# EAGLE board video-max5-revG-eagle7 (EAGLE 7.6.0)
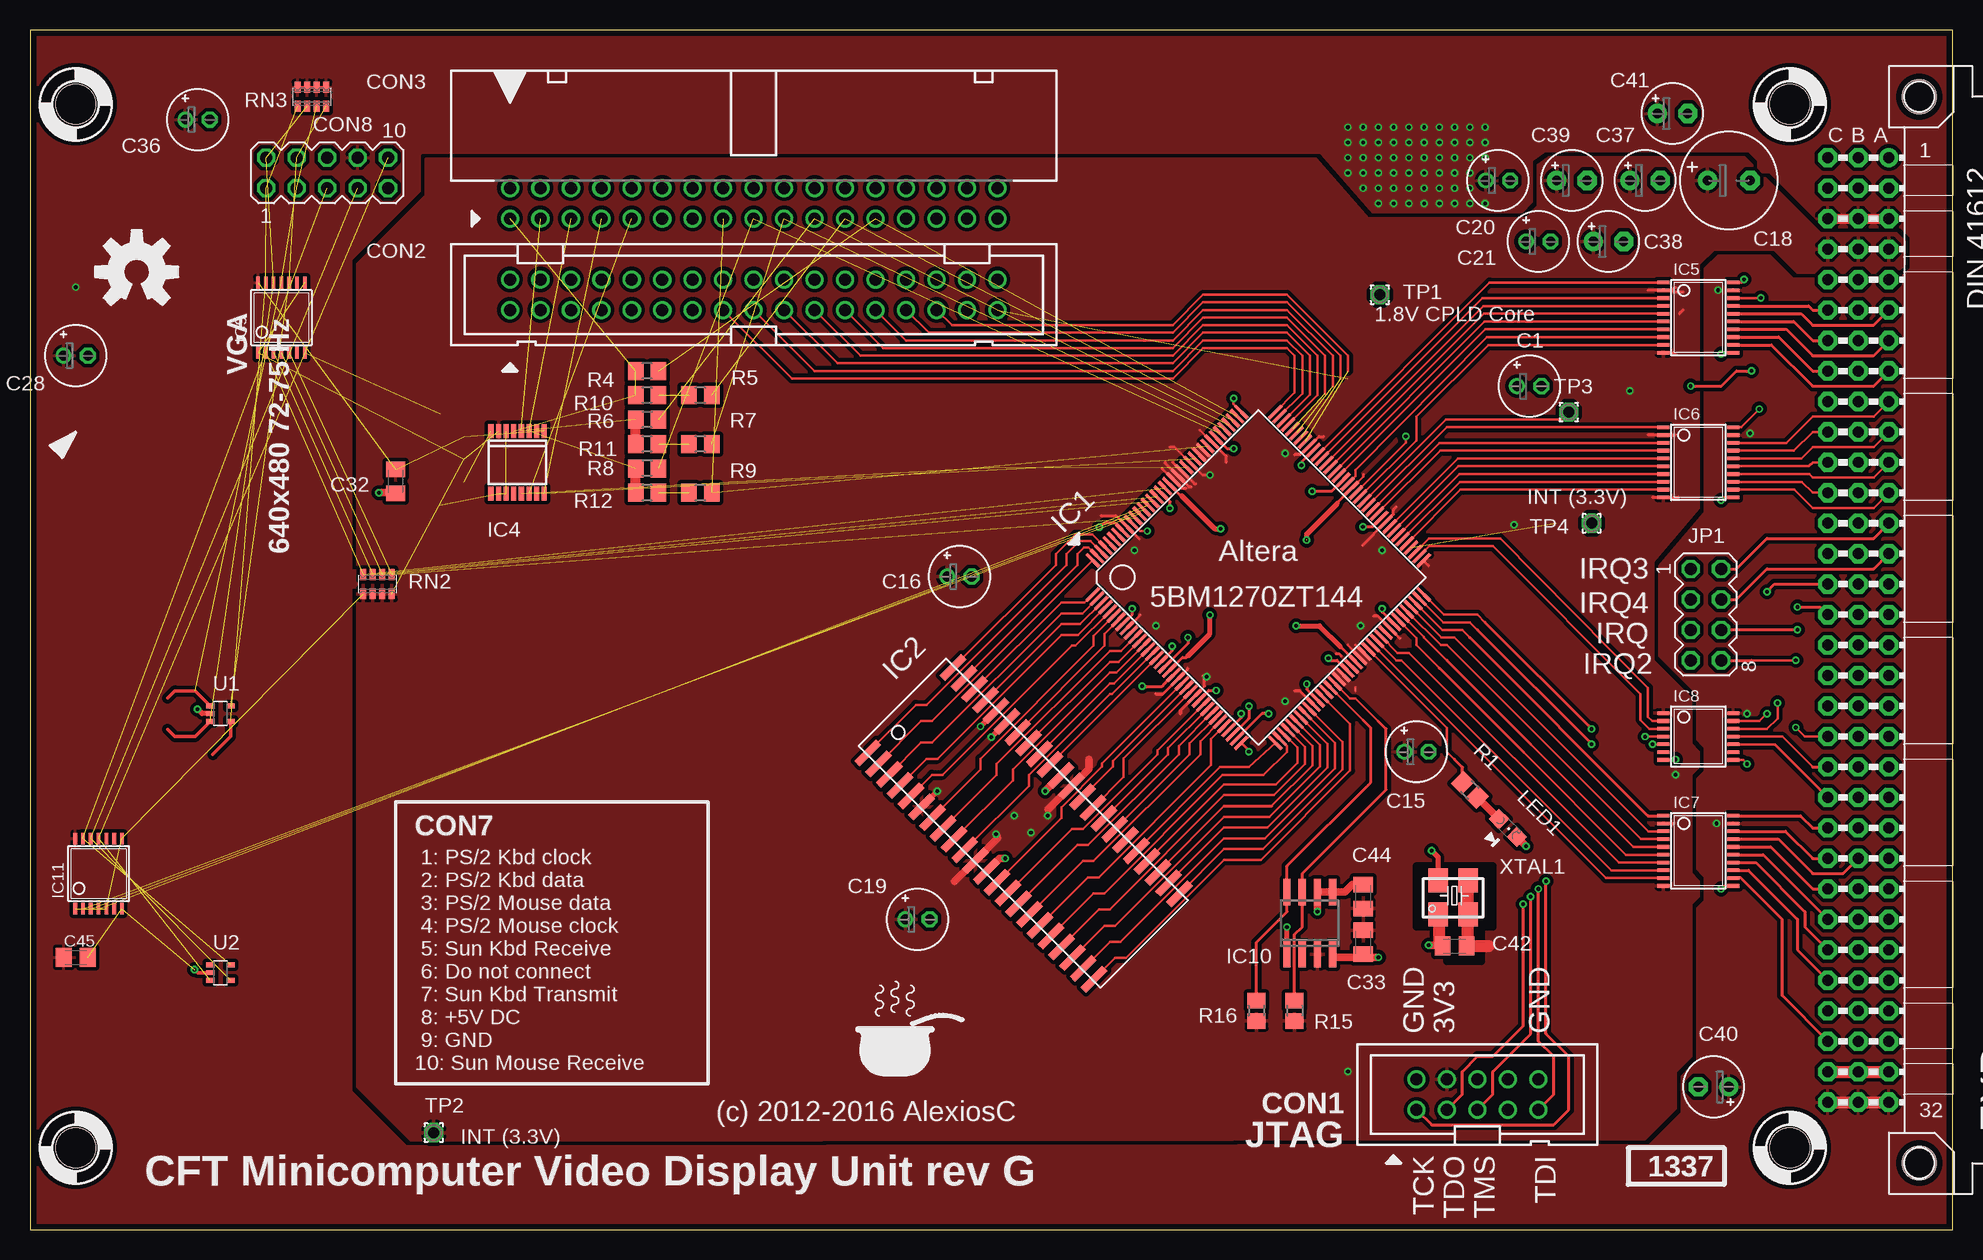
[diagram p5: board, top side]
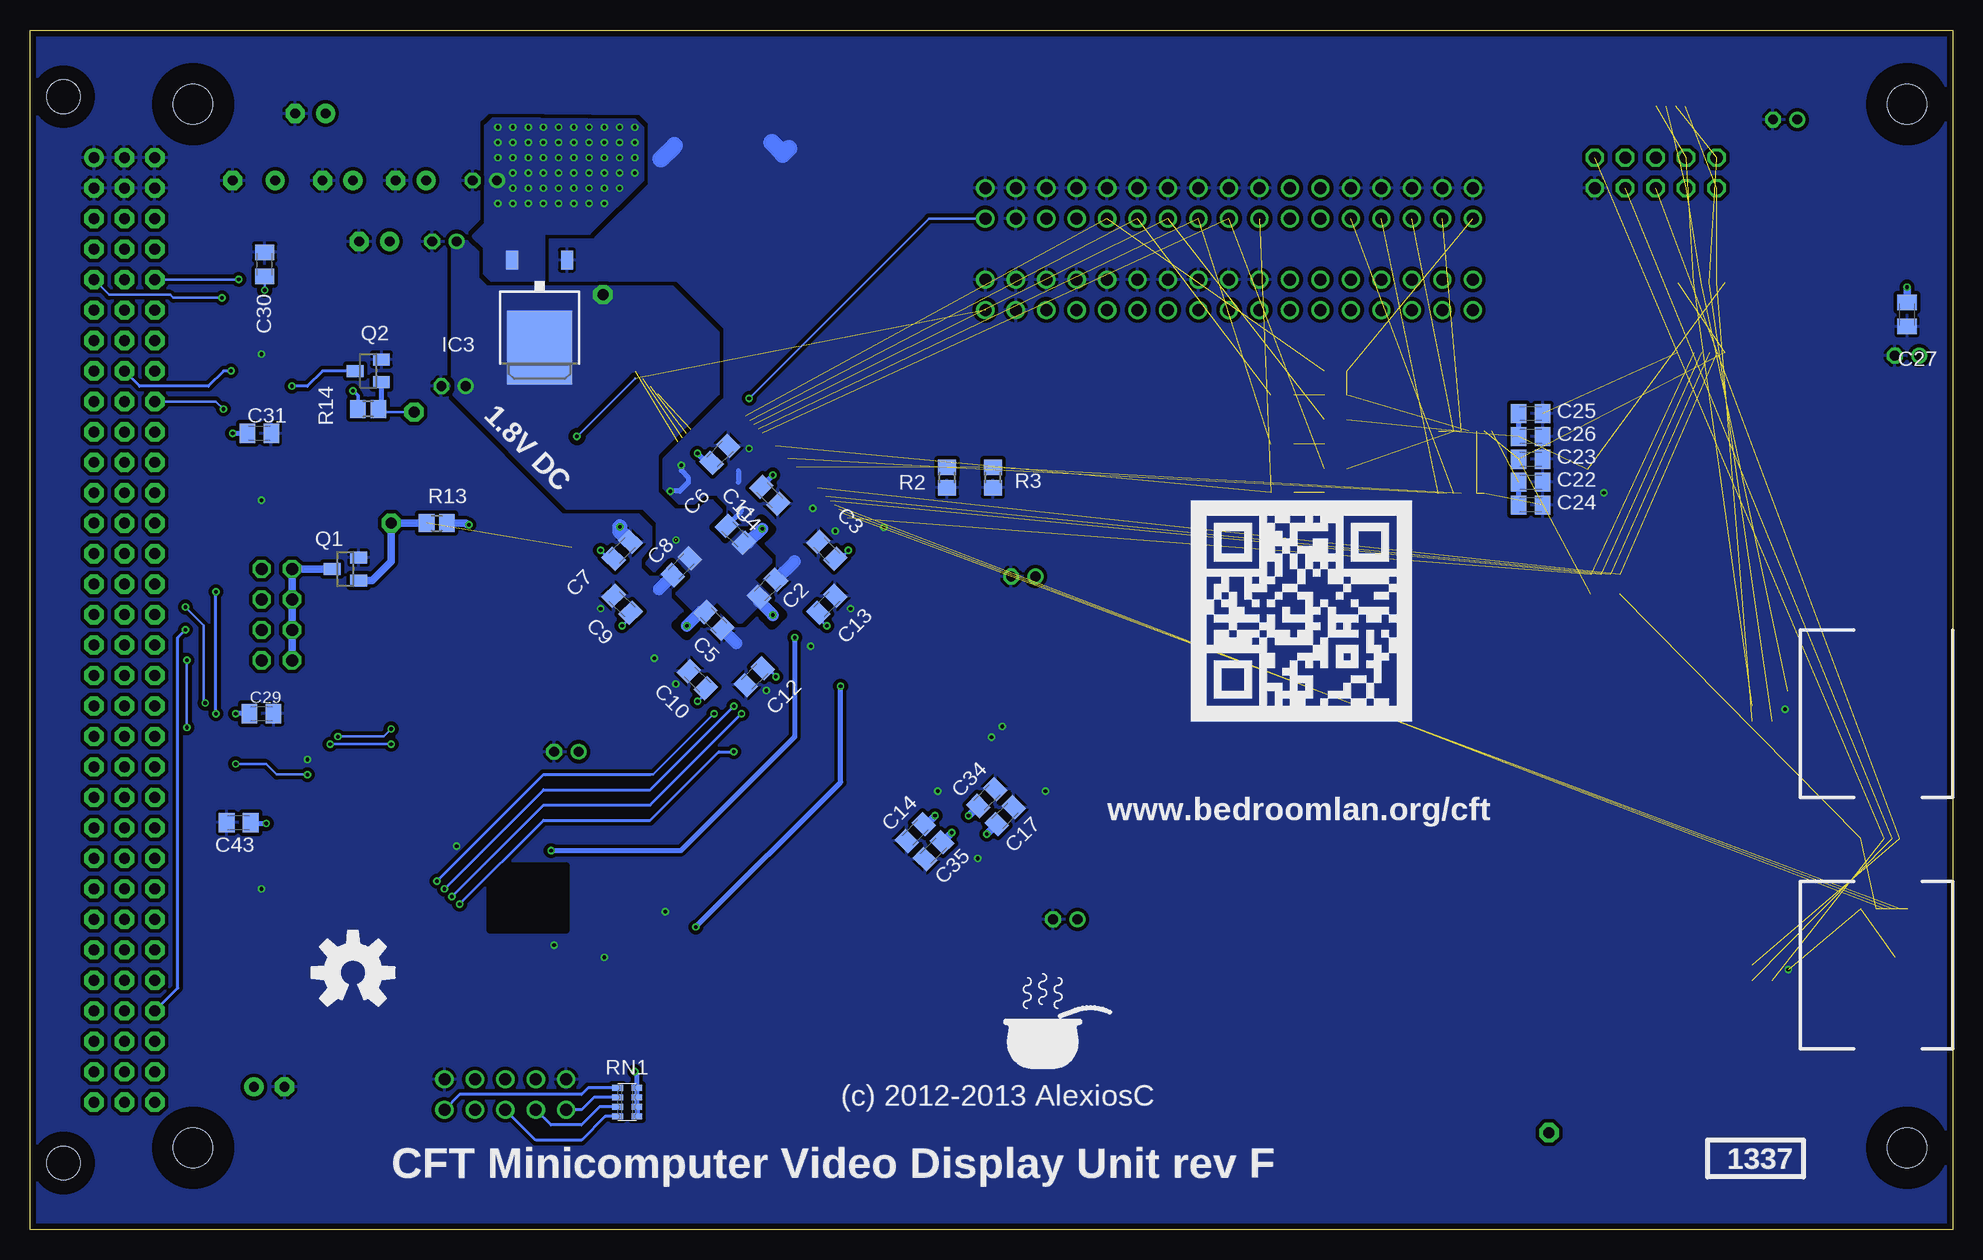
[diagram p6: board, bottom side, seen from below]

Size 160.27 x 100.03 mm. Coordinates in mm from the lower left corner, seen from the top.
Copper layers (1*16): Top 0.035mm / dielectric 1.5mm / Bottom 0.035mm
Design rules "smart-prototyping *": minimum track width 7mil, minimum drill 12mil, track to track 5mil, track to pad 5mil, pad to pad 5mil, via to via 5mil, smd to smd 0mil, copper to edge 20mil, drill to drill 10mil, minimum pad ring 10mil, minimum via ring 6mil, stop-mask expansion 2mil, vias tented up to drill 25mil, thermal gap 10mil
Net classes: 0 default: width 0.254 mm, clearance 0.152 mm; 1 low power: width 1.27 mm, clearance 0.203 mm; 2 Power Rail: width 0.61 mm, clearance 0.254 mm; 3 3.3V power: width 0.61 mm, clearance 0.203 mm; 4 Analogue: width 0.406 mm, clearance 0.203 mm
tRestrict: area 115.6,25.2 to 121.6,30; area 118.1,22.4 to 121,26.2; area 115.6,25.6 to 121.6,30.3; area 115.9,25.2 to 121.9,30; area 115.9,25.6 to 121.9,30.3
bRestrict: area 115.6,25.6 to 121.6,30.3; area 115.6,25 to 121.9,30.3; area 98.6,57.8 to 99.9,59.2; area 104.9,49.6 to 106.3,51; area 97.7,50.5 to 99.1,51.9

## Footprints (pad centres in the part's own frame; a part is rotated, then mirrored left to right if it is on the bottom)
E2-5 = drill 0.813 pad 1.27: + -1.016,0 | drill 0.813 pad 1.27 octagon: - 1.016,0
C0805K = smd 1.3 x 1.6: 1 -1,0; 2 1,0
E3,5-8 = drill 0.813 pad 1.6: + -1.778,0 | drill 0.813 pad 1.6 octagon: - 1.778,0
E2,5-5 = drill 0.813 pad 1.6: + -1.27,0 | drill 0.813 pad 1.6 octagon: - 1.27,0
SHROUDED-HEADER-2X5-2.5MM = drill 1 pad 1.422: 1 -5.08,-1.27; 2 -5.08,1.27; 3 -2.54,-1.27; 4 -2.54,1.27; 5 0,-1.27; 6 0,1.27; 7 2.54,-1.27; 8 2.54,1.27; 9 5.08,-1.27; 10 5.08,1.27
PAK100/2500-34 = drill 1 pad 1.422: 1 -20.32,-1.27; 2 -20.32,1.27; 3 -17.78,-1.27; 4 -17.78,1.27; 5 -15.24,-1.27; 6 -15.24,1.27; 7 -12.7,-1.27; 8 -12.7,1.27; 9 -10.16,-1.27; 10 -10.16,1.27; 11 -7.62,-1.27; 12 -7.62,1.27; 13 -5.08,-1.27; 14 -5.08,1.27; 15 -2.54,-1.27; 16 -2.54,1.27; 17 0,-1.27; 18 0,1.27; 19 2.54,-1.27; 20 2.54,1.27; 21 5.08,-1.27; 22 5.08,1.27; 23 7.62,-1.27; 24 7.62,1.27; 25 10.16,-1.27; 26 10.16,1.27; 27 12.7,-1.27; 28 12.7,1.27; 29 15.24,-1.27; 30 15.24,1.27; 31 17.78,-1.27; 32 17.78,1.27; 33 20.32,-1.27; 34 20.32,1.27
PAK100/2500-5-34 = drill 1 pad 1.422: 1 -20.32,-1.27; 2 -20.32,1.27; 3 -17.78,-1.27; 4 -17.78,1.27; 5 -15.24,-1.27; 6 -15.24,1.27; 7 -12.7,-1.27; 8 -12.7,1.27; 9 -10.16,-1.27; 10 -10.16,1.27; 11 -7.62,-1.27; 12 -7.62,1.27; 13 -5.08,-1.27; 14 -5.08,1.27; 15 -2.54,-1.27; 16 -2.54,1.27; 17 0,-1.27; 18 0,1.27; 19 2.54,-1.27; 20 2.54,1.27; 21 5.08,-1.27; 22 5.08,1.27; 23 7.62,-1.27; 24 7.62,1.27; 25 10.16,-1.27; 26 10.16,1.27; 27 12.7,-1.27; 28 12.7,1.27; 29 15.24,-1.27; 30 15.24,1.27; 31 17.78,-1.27; 32 17.78,1.27; 33 20.32,-1.27; 34 20.32,1.27
MA05-2 = drill 1.016 octagon: 1 -5.08,-1.27; 2 -5.08,1.27; 3 -2.54,-1.27; 4 -2.54,1.27; 5 0,-1.27; 6 0,1.27; 7 2.54,-1.27; 8 2.54,1.27; 9 5.08,-1.27; 10 5.08,1.27
VG96K = drill 0.914 pad 1.6: A1 154.94,39.37 | drill 0.914 pad 1.6 octagon: A2 154.94,36.83; A3 154.94,34.29; A4 154.94,31.75; A5 154.94,29.21; A6 154.94,26.67; A7 154.94,24.13; A8 154.94,21.59; A9 154.94,19.05; A10 154.94,16.51; A11 154.94,13.97; A12 154.94,11.43; A13 154.94,8.89; A14 154.94,6.35; A15 154.94,3.81; A16 154.94,1.27; A17 154.94,-1.27; A18 154.94,-3.81; A19 154.94,-6.35; A20 154.94,-8.89; A21 154.94,-11.43; A22 154.94,-13.97; A23 154.94,-16.51; A24 154.94,-19.05; A25 154.94,-21.59; A26 154.94,-24.13; A27 154.94,-26.67; A28 154.94,-29.21; A29 154.94,-31.75; A30 154.94,-34.29; A31 154.94,-36.83; A32 154.94,-39.37; B1 152.4,39.37; B2 152.4,36.83; B3 152.4,34.29; B4 152.4,31.75; B5 152.4,29.21; B6 152.4,26.67; B7 152.4,24.13; B8 152.4,21.59; B9 152.4,19.05; B10 152.4,16.51; B11 152.4,13.97; B12 152.4,11.43; B13 152.4,8.89; B14 152.4,6.35; B15 152.4,3.81; B16 152.4,1.27; B17 152.4,-1.27; B18 152.4,-3.81; B19 152.4,-6.35; B20 152.4,-8.89; B21 152.4,-11.43; B22 152.4,-13.97; B23 152.4,-16.51; B24 152.4,-19.05; B25 152.4,-21.59; B26 152.4,-24.13; B27 152.4,-26.67; B28 152.4,-29.21; B29 152.4,-31.75; B30 152.4,-34.29; B31 152.4,-36.83; B32 152.4,-39.37; C1 149.86,39.37; C2 149.86,36.83; C3 149.86,34.29; C4 149.86,31.75; C5 149.86,29.21; C6 149.86,26.67; C7 149.86,24.13; C8 149.86,21.59; C9 149.86,19.05; C10 149.86,16.51; C11 149.86,13.97; C12 149.86,11.43; C13 149.86,8.89; C14 149.86,6.35; C15 149.86,3.81; C16 149.86,1.27; C17 149.86,-1.27; C18 149.86,-3.81; C19 149.86,-6.35; C20 149.86,-8.89; C21 149.86,-11.43; C22 149.86,-13.97; C23 149.86,-16.51; C24 149.86,-19.05; C25 149.86,-21.59; C26 149.86,-24.13; C27 149.86,-26.67; C28 149.86,-29.21; C29 149.86,-31.75; C30 149.86,-34.29; C31 149.86,-36.83; C32 149.86,-39.37 | hole 2.794: 157.48,44.45; 157.48,-44.45
TQFP144 = smd 0.27 x 1.5: 1 -8.75,-10.75; 2 -8.25,-10.75; 3 -7.75,-10.75; 4 -7.25,-10.75; 5 -6.75,-10.75; 6 -6.25,-10.75; 7 -5.75,-10.75; 8 -5.25,-10.75; 9 -4.75,-10.75; 10 -4.25,-10.75; 11 -3.75,-10.75; 12 -3.25,-10.75; 13 -2.75,-10.75; 14 -2.25,-10.75; 15 -1.75,-10.75; 16 -1.25,-10.75; 17 -0.75,-10.75; 18 -0.25,-10.75; 19 0.25,-10.75; 20 0.75,-10.75; 21 1.25,-10.75; 22 1.75,-10.75; 23 2.25,-10.75; 24 2.75,-10.75; 25 3.25,-10.75; 26 3.75,-10.75; 27 4.25,-10.75; 28 4.75,-10.75; 29 5.25,-10.75; 30 5.75,-10.75; 31 6.25,-10.75; 32 6.75,-10.75; 33 7.25,-10.75; 34 7.75,-10.75; 35 8.25,-10.75; 36 8.75,-10.75; 73 8.75,10.75; 74 8.25,10.75; 75 7.75,10.75; 76 7.25,10.75; 77 6.75,10.75; 78 6.25,10.75; 79 5.75,10.75; 80 5.25,10.75; 81 4.75,10.75; 82 4.25,10.75; 83 3.75,10.75; 84 3.25,10.75; 85 2.75,10.75; 86 2.25,10.75; 87 1.75,10.75; 88 1.25,10.75; 89 0.75,10.75; 90 0.25,10.75; 91 -0.25,10.75; 92 -0.75,10.75; 93 -1.25,10.75; 94 -1.75,10.75; 95 -2.25,10.75; 96 -2.75,10.75; 97 -3.25,10.75; 98 -3.75,10.75; 99 -4.25,10.75; 100 -4.75,10.75; 101 -5.25,10.75; 102 -5.75,10.75; 103 -6.25,10.75; 104 -6.75,10.75; 105 -7.25,10.75; 106 -7.75,10.75; 107 -8.25,10.75; 108 -8.75,10.75 | smd 1.5 x 0.27: 37 10.75,-8.75; 38 10.75,-8.25; 39 10.75,-7.75; 40 10.75,-7.25; 41 10.75,-6.75; 42 10.75,-6.25; 43 10.75,-5.75; 44 10.75,-5.25; 45 10.75,-4.75; 46 10.75,-4.25; 47 10.75,-3.75; 48 10.75,-3.25; 49 10.75,-2.75; 50 10.75,-2.25; 51 10.75,-1.75; 52 10.75,-1.25; 53 10.75,-0.75; 54 10.75,-0.25; 55 10.75,0.25; 56 10.75,0.75; 57 10.75,1.25; 58 10.75,1.75; 59 10.75,2.25; 60 10.75,2.75; 61 10.75,3.25; 62 10.75,3.75; 63 10.75,4.25; 64 10.75,4.75; 65 10.75,5.25; 66 10.75,5.75; 67 10.75,6.25; 68 10.75,6.75; 69 10.75,7.25; 70 10.75,7.75; 71 10.75,8.25; 72 10.75,8.75; 109 -10.75,8.75; 110 -10.75,8.25; 111 -10.75,7.75; 112 -10.75,7.25; 113 -10.75,6.75; 114 -10.75,6.25; 115 -10.75,5.75; 116 -10.75,5.25; 117 -10.75,4.75; 118 -10.75,4.25; 119 -10.75,3.75; 120 -10.75,3.25; 121 -10.75,2.75; 122 -10.75,2.25; 123 -10.75,1.75; 124 -10.75,1.25; 125 -10.75,0.75; 126 -10.75,0.25; 127 -10.75,-0.25; 128 -10.75,-0.75; 129 -10.75,-1.25; 130 -10.75,-1.75; 131 -10.75,-2.25; 132 -10.75,-2.75; 133 -10.75,-3.25; 134 -10.75,-3.75; 135 -10.75,-4.25; 136 -10.75,-4.75; 137 -10.75,-5.25; 138 -10.75,-5.75; 139 -10.75,-6.25; 140 -10.75,-6.75; 141 -10.75,-7.25; 142 -10.75,-7.75; 143 -10.75,-8.25; 144 -10.75,-8.75
SOJ44-4 = smd 0.635 x 2.54: 1 -13.335,-5.029; 2 -12.065,-5.029; 3 -10.795,-5.029; 4 -9.525,-5.029; 5 -8.255,-5.029; 6 -6.985,-5.029; 7 -5.715,-5.029; 8 -4.445,-5.029; 9 -3.175,-5.029; 10 -1.905,-5.029; 11 -0.635,-5.029; 12 0.635,-5.029; 13 1.905,-5.029; 14 3.175,-5.029; 15 4.445,-5.029; 16 5.715,-5.029; 17 6.985,-5.029; 18 8.255,-5.029; 19 9.525,-5.029; 20 10.795,-5.029; 21 12.065,-5.029; 22 13.335,-5.029; 23 13.335,5.029; 24 12.065,5.029; 25 10.795,5.029; 26 9.525,5.029; 27 8.255,5.029; 28 6.985,5.029; 29 5.715,5.029; 30 4.445,5.029; 31 3.175,5.029; 32 1.905,5.029; 33 0.635,5.029; 34 -0.635,5.029; 35 -1.905,5.029; 36 -3.175,5.029; 37 -4.445,5.029; 38 -5.715,5.029; 39 -6.985,5.029; 40 -8.255,5.029; 41 -9.525,5.029; 42 -10.795,5.029; 43 -12.065,5.029; 44 -13.335,5.029
TO252 = smd 1 x 1.6: 1 -2.28,-4.8; 2 2.28,-4.8 | smd 5.4 x 6.2: 3 0,2.5
SSOP16 = smd 0.419 x 1.143: 1 -2.223,-2.6; 2 -1.587,-2.6; 3 -0.953,-2.6; 4 -0.318,-2.6; 5 0.318,-2.6; 6 0.953,-2.6; 7 1.587,-2.6; 8 2.223,-2.6; 9 2.223,2.6; 10 1.587,2.6; 11 0.953,2.6; 12 0.318,2.6; 13 -0.318,2.6; 14 -0.953,2.6; 15 -1.587,2.6; 16 -2.223,2.6
TSSOP20 = smd 0.305 x 0.991: 1 -2.925,-2.918; 2 -2.275,-2.918; 3 -1.625,-2.918; 4 -0.975,-2.918; 5 -0.325,-2.918; 6 0.325,-2.918; 7 0.975,-2.918; 8 1.625,-2.918; 9 2.275,-2.918; 10 2.925,-2.918; 11 2.925,2.918; 12 2.275,2.918; 13 1.625,2.918; 14 0.975,2.918; 15 0.325,2.918; 16 -0.325,2.918; 17 -0.975,2.918; 18 -1.625,2.918; 19 -2.275,2.918; 20 -2.925,2.918
TSSOP14 = smd 0.305 x 0.991: 1 -1.95,-2.918; 2 -1.3,-2.918; 3 -0.65,-2.918; 4 0,-2.918; 5 0.65,-2.918; 6 1.3,-2.918; 7 1.95,-2.918; 8 1.95,2.918; 9 1.3,2.918; 10 0.65,2.918; 11 0,2.918; 12 -0.65,2.918; 13 -1.3,2.918; 14 -1.95,2.918
SO08 = smd 0.6 x 2.2: 1 -1.905,-2.6; 2 -0.635,-2.6; 3 0.635,-2.6; 4 1.905,-2.6; 5 1.905,2.6; 6 0.635,2.6; 7 -0.635,2.6; 8 -1.905,2.6
MA04-2 = drill 1.016 octagon: 1 -3.81,-1.27; 2 -3.81,1.27; 3 -1.27,-1.27; 4 -1.27,1.27; 5 1.27,-1.27; 6 1.27,1.27; 7 3.81,-1.27; 8 3.81,1.27
CHIPLED_0805 = smd 1.2 x 1.2: A 0,-1.05; C 0,1.05
SOT23 = smd 1 x 1.4: 1 -0.95,-1.1; 2 0.95,-1.1; 3 0,1.1
R0805 = smd 1.3 x 1.5: 1 -0.85,0; 2 0.85,0
R0805' = smd 1.3 x 1.5: 1 -0.95,0; 2 0.95,0
CTS742C083 = smd 0.5 x 0.9: 1 -1.2,-0.8; 2 -0.4,-0.8; 3 0.4,-0.8; 4 1.2,-0.8; 5 1.2,0.8; 6 0.4,0.8; 7 -0.4,0.8; 8 -1.2,0.8
1,6/0,9 = drill 0.914 pad 1.6 octagon: 1 0,0
SC70-5 = smd 0.4 x 0.7: 1 -0.65,-0.85; 2 0,-0.85; 3 0.65,-0.85; 4 0.65,0.85; 5 -0.65,0.85
STANDOFF_28_60 = hole 3.302: 0,0
CRYSTAL-SMD-5X3.2MM = smd 1.6 x 2: 1 1.125,-1.475; 2 -1.375,-1.475; 3 -1.375,1.35; 4 1.125,1.35

## Placement (x,y rotation side)
$4_37_$1  SIGNATURESILK  [SIGNATURE]  78.74,13.18 0 bottom
$4_39_$  OSHW-LOGOL  [OSHW-LOGO-L]  8.89,79.86 0 top
$4_39_$1  OSHW-LOGOL  [OSHW-LOGO-L]  133.35,21.44 0 bottom
$4_40_$  QRCODE-CFT  [CFT-QRCODE]  63.5,42.39 0 bottom
C1  47uF  [E2-5]  124.97,70.33 0 top
C2  0.1uF  [C0805K]  98.8,53.5 225 bottom
C3  0.1uF  [C0805K]  93.86,56.64 315 bottom
C4  0.1uF  [C0805K]  98.61,61.23 315 bottom
C5  0.1uF  [C0805K]  103.29,50.8 135 bottom
C6  0.1uF  [C0805K]  102.76,64.66 225 bottom
C7  0.1uF  [C0805K]  110.92,56.64 45 bottom
C8  0.1uF  [C0805K]  105.98,55.29 45 bottom
C9  0.1uF  [C0805K]  110.92,52.15 315 bottom
C10  0.1uF  [C0805K]  104.63,45.86 135 bottom
C11  0.1uF  [C0805K]  101.49,57.99 315 bottom
C12  0.1uF  [C0805K]  99.89,46.12 45 bottom
C13  0.1uF  [C0805K]  93.86,52.15 45 bottom
C14  0.1uF  [C0805K]  86.49,33.12 225 bottom
C15  47uF  [E2-5]  115.57,39.85 0 top
C16  47uF  [E2-5]  77.47,54.46 0 top
C17  0.1uF  [C0805K]  78.99,34.52 45 bottom
C18  47uF  [E3,5-8]  141.6,87.48 0 top
C19  47uF  [E2-5]  73.98,25.88 0 top
C20  10uF  [E2-5]  122.36,87.48 0 top
C21  22uF  [E2-5]  125.73,82.4 0 top
C22  0.1uF  [C0805K]  35.18,62.33 0 bottom
C23  0.1uF  [C0805K]  35.18,64.24 0 bottom
C24  0.1uF  [C0805K]  35.18,60.43 0 bottom
C25  0.1uF  [C0805K]  35.18,68.05 0 bottom
C26  0.1uF  [C0805K]  35.18,66.14 0 bottom
C27  0.1uF  [C0805K]  3.81,76.3 270 bottom
C28  47uF  [E2-5]  3.81,72.87 0 top
C29  0.1uF  [C0805K]  140.97,43.03 0 bottom
C30  0.1uF  [C0805K]  140.72,80.49 90 bottom
C31  0.1uF  [C0805K]  141.16,66.4 0 bottom
C32  0.1uF  [C0805K]  30.48,62.4 270 top
C33  0.1uF  [C0805K]  111.12,23.98 270 top
C34  1uF  [C0805K]  80.52,36.04 45 bottom
C35  1uF  [C0805K]  84.96,31.6 225 bottom
C36  22uF  [E2-5]  13.97,92.56 0 top
C37  1uF  [E2,5-5]  134.62,87.48 0 top
C38  1uF  [E2,5-5]  131.57,82.4 0 top
C39  1uF  [E2,5-5]  128.52,87.48 0 top
C40  1uF  [E2,5-5]  140.34,11.91 180 top
C41  1uF  [E2,5-5]  136.91,93.07 0 top
C42  0.1uF  [C0805K]  118.75,23.66 0 top
C43  0.1uF  [C0805K]  142.88,33.95 180 bottom
C44  1uF  [C0805K]  111.12,27.79 90 top
C45  0.1uF  [C0805K]  3.81,22.71 0 top
CON1  JTAG-ALTERA  [SHROUDED-HEADER-2X5-2.5MM]  120.65,11.28 0 top
CON2  2534-  [PAK100/2500-34]  60.33,77.95 0 top
CON3  2534-5  [PAK100/2500-5-34]  60.33,85.57 0 top
CON8  [MA05-2]  24.77,88.11 0 top
EXP  [VG96K]  0,50.01 0 top
IC1  5M570ZT144  [TQFP144]  102.39,54.39 315 top
IC2  AS7C34098A  [SOJ44-4]  82.82,33.88 315 top
IC3  AP1117D18  [TO252]  117.79,76.05 180 bottom
IC4  TPD7S019-15DBQR  [SSOP16]  40.64,63.98 180 top
IC5  TXB0108PWR  [TSSOP20]  139.06,76.05 270 top
IC6  TXB0108PWR  [TSSOP20]  139.06,63.98 270 top
IC7  TXB0108PWR  [TSSOP20]  139.06,31.6 270 top
IC8  TXB0104PWR  [TSSOP14]  139.06,41.12 270 top
IC9  LSF0204PW  [TSSOP14]  20.95,76.05 0 top
IC10  DS1085L  [SO08]  106.68,25.57 0 top
IC11  LSF0204PW  [TSSOP14]  5.71,29.69 0 top
JP1  [MA04-2]  139.7,51.28 270 top
LED1  LED-5MM-GREEN  [CHIPLED_0805]  123.19,33.5 225 top
Q1  BSS138  [SOT23]  133.99,55.09 90 bottom
Q2  BSS138  [SOT23]  132.08,71.6 90 bottom
R1  330R  [R0805]  120.02,36.68 315 top
R2  4k7  [R0805]  83.82,62.71 90 bottom
R3  4k7  [R0805]  80.01,62.71 90 bottom
R4  412R  [R0805']  51.44,71.6 180 top
R5  412R  [R0805']  55.88,69.57 180 top
R6  412R  [R0805']  51.44,67.54 180 top
R7  412R  [R0805']  55.88,65.51 180 top
R8  412R  [R0805']  51.44,63.47 180 top
R9  412R  [R0805']  55.88,61.44 180 top
R10  412R  [R0805']  51.44,69.57 180 top
R11  412R  [R0805']  51.44,65.51 180 top
R12  412R  [R0805']  51.44,61.44 180 top
R13  4k7  [R0805]  126.36,58.9 0 bottom
R14  4k7  [R0805]  132.08,68.43 180 bottom
R15  4k7  [R0805]  105.41,18.26 270 top
R16  4k7  [R0805]  102.23,18.26 270 top
RN1  4.7k  [CTS742C083]  110.49,10.64 270 bottom
RN2  4.7k  [CTS742C083]  28.96,53.82 180 top
RN3  4.7k  [CTS742C083]  23.5,94.46 0 top
TP1  [1,6/0,9]  112.52,77.95 0 top
TP2  [1,6/0,9]  33.66,8.1 0 top
TP3  [1,6/0,9]  128.27,68.17 0 top
TP4  [1,6/0,9]  130.18,58.9 180 top
U1  BZA856AVL  [SC70-5]  15.88,43.03 270 top
U2  BZA856AVL  [SC70-5]  15.88,21.44 270 top
U3  HOLE  [STANDOFF_28_60]  3.81,93.83 0 top
U4  HOLE  [STANDOFF_28_60]  3.81,6.83 0 top
U5  HOLE  [STANDOFF_28_60]  146.69,93.83 0 top
U6  HOLE  [STANDOFF_28_60]  146.69,6.83 0 top
U$1  SIGNATURESILK  [SIGNATURE]  69.22,12.55 0 top
XTAL1  64.000  [CRYSTAL-SMD-5X3.2MM]  118.75,27.79 0 top

## Tracks (layer width: path | path; a pad name or v marks a point on that pad's centre or on a via)
!IODEV1XX
  Top 0.254: IC7.17 145.71,32.57 148.59,29.69 151.13,29.69 EXP.B24
!IODEV1XX-3V3
  Top 0.203: IC1.68 117.59,48.74 118.11,48.74 134.28,32.57 IC7.4
!IRQ  (via drill 0.3)
  Top 0.254: v147.32,50.01 JP1.6
  Bottom 0.254: EXP.C29 147.96,20.17 147.96,49.38 v147.32,50.01
!IRQ2  (via drill 0.3)
  Top 0.203: 143.51,47.47 v147.19,47.47 | v147.19,41.88 147.96,41.12 EXP.C20
  Top 0.254: JP1.8 143.51,47.47
  Bottom 0.203: v147.19,47.47 v147.19,41.88
!IRQ3
  Top 0.254: JP1.2 142.24,55.09 144.78,57.63 153.67,57.63 EXP.A13
!IRQ4
  Top 0.254: JP1.4 142.24,52.55 144.78,55.09 153.67,55.09 EXP.A14
!PR
  Top 0.203: IC2.41 85.96,50.49 87.53,50.49 IC1.3
!PW
  Top 0.203: IC1.32 98.46,40.92 98.46,38.74 89.11,29.39 88.21,29.39 IC2.17
!R  (via drill 0.3)
  Top 0.203: IC8.13 144.16,42.41 v144.78,43.03
  Top 0.254: v144.78,53.19 145.41,53.82 EXP.C15
  Bottom 0.254: v144.78,43.03 v144.78,53.19
!R-3V3
  Top 0.203: IC1.75 116.59,57.63 122.56,57.63 134.87,45.19 134.87,42.77 135.22,42.42 IC8.2
!RESET
  Top 0.254: IC7.12 142.61,29.32 146.05,25.88 146.05,19.53 EXP.C30
!RESET-3V3
  Top 0.203: IC1.60 131.35,29.32 IC7.9
!W  (via drill 0.3)
  Top 0.203: IC8.12 144.78,41.76 145.67,42.65 v145.67,43.92
  Top 0.254: v147.32,51.92 149.22,51.92 EXP.C16
  Bottom 0.203: v147.32,51.92 145.8,50.39 145.8,44.04 v145.67,43.92
!W-3V3
  Top 0.203: IC1.74 116.66,57 121.92,57 134.24,44.68 134.24,42.52 134.99,41.77 IC8.3
!WS  (via drill 0.3)
  Top 0.254: v138.43,70.33 140.97,70.33 142.24,71.6 v143.51,71.6
  Bottom 0.254: EXP.B8 151.13,70.33 145.41,70.33 144.15,71.6 v143.51,71.6 | v138.43,70.33 137.16,70.33 135.89,71.6 Q2.3
+3V3  (via drill 0.3)  (7 unrouted)
  Top 0.203: IC1.25 97.9,45.31 | 97.9,45.31 | IC1.58 111.2,48.03 110.49,48.74 | IC1.57 110.87,47.72 109.86,48.74 | 110.49,45.23 110.49,44.93 | v98.35,62.92 97.75,62.92 IC1.121 95.38,65.25 95.04,65.25 | IC1.116 97.54,66.67 | IC8.8 142.79,39.17 v143.13,38.84 | 106.93,65.63 106.91,65.63 IC1.100
  Top 0.254: 111.09,57.08 IC1.82 113.67,59.66 113.67,60.04 113.89,60.26 | 114.19,49.31 IC1.64 112.34,51.16 112.01,51.16 | IC1.136 92.48,57.59 | IC1.9 92.55,51.27 | IC1.100 105.89,64.62 105.41,64.62 | IC1.116 99.69,64.51 99.69,63.98 | 93.85,44.68 94.44,44.68 IC1.21 96.52,46.76 96.52,46.84 | IC1.46 105.84,44.93 105.41,44.93 | 109.3,47.83 109.1,48.03 108.88,48.03 | 97.9,45.31 97.9,46.09 97.79,46.2 | 91.59,58.48 90.53,59.54 89.28,59.54 | 137.49,76.37 137.79,76.68 | 136.9,78.32 IC5.2 134.88,78.32 | 136.9,78.32 137.16,78.59 | IC5.10 137.04,73.12 137.16,73 | 136.9,78.32 137.01,78.21 137.79,78.21 | 137.16,66.27 137.15,66.26 IC6.2 134.88,66.26 | 137.16,61.06 | 135.25,61.06 135.26,61.06 IC6.10 137.42,61.06 | IC1.73 116.18,55.76 116.59,55.35 | IC7.2 137.02,33.87 137.03,33.88 | 94.36,63.47 94.37,63.47 IC1.125 96.02,61.82 | 94.61,63.98 94.61,63.94 IC1.124 96.6,61.95 96.77,61.95 | 95.25,63.98 95.28,63.98 IC1.123 97.05,62.2 97.16,62.2 | 96.02,61.82 96.39,61.82 | 96.02,61.82 96.01,61.82 | 106.93,65.63 107.44,66.14 107.82,66.14
  Top 0.305: XTAL1.1 119.87,24.12 120.02,23.98 | IC1.25 95.89,43.29 95.89,43.03
  Top 0.61: 84.86,35.03 IC2.33 88.27,38.43 88.27,39.22 | v80.52,32.99 80.64,32.64 77.07,29.06
  Top 1.016: XTAL1.4 XTAL1.1 119.87,23.78 C42.2 121.6,23.66
  Bottom 0.203: v143.13,38.84 140.59,38.84 139.7,37.95 v137.16,37.95
  Bottom 0.254: v98.09,46.12 98.8,46.82 C12.2 | C6.2 103.93,64.01 | C9.2 110.21,51.06 v110.92,50.35 | C3.2 92.77,55.93 v92.06,56.64 | C7.1 112.01,55.93 v112.72,56.64 | C10.1 103.93,44.77 v104.63,44.07 | C13.1 94.56,51.06 v93.86,50.35 | 99.06,62.22 C4.1 | v123.7,58.78 123.83,58.78 | C14.1 85.65,34.24
  Bottom 0.305: R14.2 132.93,69.53 v133.35,69.95
  Bottom 0.406: RN1.5 RN1.6 RN1.7 RN1.8 109.69,13.02 v109.86,13.18 | v98.35,62.92 99.06,62.22 | 103.93,64.01 v104.63,64.72
  Bottom 0.61: 123.83,58.78 123.95,58.9 R13.2 | v80.52,32.99 C17.1 79.57,33.81 | C34.1 v82.04,34.52 | v83.44,33.12 C35.1 | 85.47,33.76 85.58,33.76 85.65,33.83 C14.1 85.53,33.83 v84.84,34.52
  pour Top (isolate 0.305, rank 2): 27.3,80.49 27.3,11.91 31.75,7.47 134.62,7.59 137.16,10.13 137.16,13.18 138.43,14.45 138.43,27.15 139.06,27.79 139.06,29.06 138.43,29.69 138.43,37.95 139.06,38.58 139.06,39.85 138.43,40.49 138.43,44.3 135.25,47.47 135.25,55.73 139.06,60.17 139.06,80.49 140.34,81.76 145.41,81.76 147.32,79.86 155.57,79.86 156.21,80.49 156.21,82.4 155.57,83.03 149.22,83.03 142.88,89.38 126.62,89.38 125.73,88.75 125.73,85.32 124.71,84.3 111.51,84.3 107.19,89.26 33.02,89.26 33.02,86.21
  pour Top (isolate 0.254, no thermals): 97.16,66.52 95.89,65.25 97.79,63.35 99.31,64.87 97.66,66.52
  pour Top (isolate 0.254, rank 2, no thermals): 107.82,46.46 110.74,49.25 112.39,47.47 112.39,45.44 110.87,43.92 110.49,44.3 109.98,44.3
  pour Top (no thermals): 94.49,63.35 96.01,61.82 96.14,61.82 96.77,62.46 95.25,63.98 95.12,63.98
  pour Top (isolate 0.406): 113.03,58.9 113.67,58.9 119.13,64.36 119.13,65 117.6,65 112.39,59.79 112.39,59.54
+12V
  Top 1.016: EXP.C31 EXP.B31 EXP.A31
AB0  (via drill 0.3)
  Top 0.203: IC5.18 144.25,77.67 v144.27,77.7
  Bottom 0.203: v144.27,77.7 148.34,77.7 148.59,77.95 153.67,77.95 EXP.A5
AB0-3V3
  Top 0.203: IC1.97 121.07,77.67 IC5.3
AB1
  Top 0.254: IC5.16 147.63,76.37 148.59,75.41 153.67,75.41 EXP.A6
AB1-3V3
  Top 0.203: IC1.95 121.19,76.37 IC5.5
AB2
  Top 0.254: IC5.14 146.39,75.07 148.59,72.87 153.67,72.87 EXP.A7
AB2-3V3
  Top 0.203: IC1.93 121.3,75.07 IC5.7
AB3
  Top 0.254: IC5.12 145.15,73.77 148.59,70.33 153.67,70.33 EXP.A8
AB3-3V3
  Top 0.203: IC1.88 115.57,65.81 115.57,67.79 121.55,73.77 IC5.9
AB4
  Top 0.203: IC6.18 146.41,65.61 148.59,67.79 153.67,67.79 EXP.A9
AB4-3V3
  Top 0.203: IC1.85 117.49,65.61 IC6.3
AB5
  Top 0.203: IC6.16 147.65,64.31 148.59,65.25 153.67,65.25 EXP.A10
AB5-3V3
  Top 0.203: IC1.81 119.02,64.31 IC6.5
AB6
  Top 0.203: IC6.14 148.29,63.01 148.59,62.71 153.67,62.71 EXP.A11
AB6-3V3
  Top 0.203: IC1.79 119.14,63.01 IC6.7
AB7
  Top 0.203: IC6.12 147.06,61.71 148.59,60.17 153.67,60.17 EXP.A12
AB7-3V3
  Top 0.203: IC1.77 119.25,61.71 IC6.9
B0  (2 unrouted)
B0-IN
  Top 0.203: CON2.17 65.41,71.6 95.25,71.6 97.79,74.14 104.78,74.14 106.05,72.87 106.05,69.72 IC1.107 104.14,67.79
B1  (2 unrouted)
B1-IN
  Top 0.203: IC1.108 105.41,69.79 105.41,72.87 104.78,73.51 97.79,73.51 95.25,70.97 63.5,70.97 CON2.15
BLUE  (2 unrouted)
  Top 0.813: R12.2 R8.2
CG/!P!
  Top 0.203: IC2.44 85.51,55.43 85.51,56.33 87.13,57.95 88.58,57.95 IC1.141
CLK  (via drill 0.3)
  Top 0.254: IC1.18 96.52,48.88 v96.52,49.38
  Top 0.406: v116.84,31.6 117.37,31.07 XTAL1.3
  Bottom 0.406: v96.52,49.38 96.52,41.12 106.05,31.6 v116.84,31.6
DB0  (via drill 0.3)
  Top 0.203: IC5.20 142.62,78.97 v142.88,79.22
  Bottom 0.203: v142.88,79.22 EXP.C5
DB0-3V3
  Top 0.203: IC1.98 121.67,78.97 IC5.1
DB1
  Top 0.254: IC5.17 148.25,77.02 148.59,76.68 EXP.C6
DB1-3V3
  Top 0.203: IC1.96 121.13,77.02 IC5.4
DB2
  Top 0.254: IC5.15 147.01,75.72 148.59,74.14 EXP.C7
DB2-3V3
  Top 0.203: IC1.94 121.24,75.72 IC5.6
DB3
  Top 0.254: IC5.13 145.77,74.42 148.59,71.6 EXP.C8
DB3-3V3
  Top 0.203: IC1.91 110.49,62.85 110.49,63.35 121.43,74.42 IC5.8
DB4  (via drill 0.3)
  Top 0.203: IC6.20 142.62,66.91 v144.15,68.43
  Bottom 0.203: v144.15,68.43 144.78,69.06 EXP.C9
DB4-3V3
  Top 0.203: IC1.86 118.08,66.91 IC6.1
DB5
  Top 0.203: IC6.17 147.03,64.96 148.59,66.52 EXP.C10
DB5-3V3
  Top 0.203: IC1.84 117.55,64.96 IC6.4
DB6
  Top 0.203: IC6.15 148.26,63.66 148.59,63.98 EXP.C11
DB6-3V3
  Top 0.203: IC1.80 119.08,63.66 IC6.6
DB7
  Top 0.203: IC6.13 147.68,62.36 148.59,61.44 EXP.C12
DB7-3V3
  Top 0.203: IC1.78 119.19,62.36 IC6.8
DB8
  Top 0.203: IC8.11 146.05,41.12 148.59,38.58
  Top 0.254: 148.59,38.58 EXP.C21
DB8-3V3  (via drill 0.3)
  Top 0.203: IC1.72 117.87,51.28 120.65,51.28 121.28,50.65 | v134.62,41.12 IC8.4
  Top 0.254: 121.28,50.65 v130.18,41.76
  Bottom 0.203: v130.18,41.76 130.81,41.12 v134.62,41.12
DB9
  Top 0.203: IC8.10 145.43,40.47 145.44,40.46
  Top 0.254: 145.44,40.46 EXP.C22
DB9-3V3  (via drill 0.3)
  Top 0.203: IC1.71 117.8,50.65 120.02,50.65 120.65,50.01 | 130.19,40.47 130.21,40.49 | v135.25,40.49 135.27,40.47 IC8.5
  Top 0.254: 120.65,50.01 v130.18,40.49 130.19,40.47
  Bottom 0.203: v130.18,40.49 v135.25,40.49
DB10
  Top 0.254: IC7.20 147.57,34.52 148.59,33.5 EXP.C23
DB10-3V3
  Top 0.203: IC1.70 117.73,50.01 119.38,50.01 120.02,49.38
  Top 0.254: 120.02,49.38 134.87,34.52 IC7.1
DB11
  Top 0.254: IC7.18 146.33,33.22 148.59,30.96 EXP.C24
DB11-3V3
  Top 0.203: IC1.69 117.66,49.38 118.75,49.38 134.9,33.22 IC7.3
DB12
  Top 0.254: IC7.16 145.09,31.92 148.59,28.42 EXP.C25
DB12-3V3
  Top 0.203: IC1.67 116.2,49.42 116.2,49.38 118.11,47.47 | 125.1,40.48 133.66,31.92 IC7.5
  Top 0.254: 118.11,47.47 125.1,40.48
DB13
  Top 0.254: IC7.15 144.47,31.27 EXP.C26
DB13-3V3
  Top 0.203: IC1.66 115.57,49.34 115.57,48.74 117.47,46.84 | 124.48,39.83 133.04,31.27 IC7.6
  Top 0.254: 117.47,46.84 124.48,39.83
DB14
  Top 0.254: IC7.14 143.85,30.62 147.96,26.52 147.96,25.25 EXP.C27
DB14-3V3
  Top 0.203: IC1.62 113.98,48.11 114.94,48.11 132.42,30.62 IC7.7
DB15
  Top 0.254: IC7.13 143.23,29.97 147.32,25.88 147.32,23.34 EXP.C28
DB15-3V3
  Top 0.203: IC1.61 113.91,47.47 114.3,47.47 131.8,29.97 IC7.8
G0  (2 unrouted)
G0-IN
  Top 0.203: CON2.21 69.22,72.87 95.25,72.87 97.79,75.41 104.78,75.41 107.31,72.87 107.31,69.57 IC1.105
G1  (2 unrouted)
G1-IN
  Top 0.203: IC1.106 106.68,69.64 106.68,72.87 104.78,74.78 97.79,74.78 95.25,72.24 67.31,72.24 CON2.19
GND  (via drill 0.3)  (6 unrouted)
  Top 0.203: C32.2 30.43,61.44 | 91.73,59.05 IC1.135 92.52,58.26 v93.14,58.26 | IC10.4 108.83,22.72 | C33.2 111.14,22.96 111.14,22.71 | IC6.11 141.22,61.06 v140.97,60.81 | IC8.7 137.12,39.17 v137.16,39.22 | IC7.11 141.22,28.67 v140.97,28.42
  Top 0.254: IC1.115 99.74,65.17 99.79,65.13 v100.33,65.13 | 105.98,64 IC1.99 | IC1.92 108.51,61.58 v106.89,61.58 | 111.91,58.61 IC1.83 | IC1.65 112.72,51.49 v112.72,51.79 | IC1.47 106.43,45.05 v106.43,45.5 | IC1.26 98.26,44.96 v98.89,44.96 | IC1.8 91.88,51.31 v91.88,51.79 | IC1.17 95.2,48.27 v95.2,48.65 | 105.98,64 | v105.98,63.73 105.98,64 | 111.91,58.61 | v111.1,58.61 111.91,58.61 | IC1.128 95.03,60.7 v95.03,60.14 | IC1.54 108.96,47.47 108.41,47.47 v108.23,47.66 | IC1.137 90.45,58.9 89.53,58.9 89.2,58.57 v89.11,58.57 | IC5.11 141.09,73.12 v140.97,73
  Top 0.305: U2.2 13.97,21.44 v13.72,21.69
  Top 0.406: v80.12,41.06 IC2.39 | IC2.6 v75.63,36.57 | IC2.40 v79.23,41.96 | v13.97,43.41 14.35,43.03 U1.2
  Top 0.61: IC2.34 v84.61,36.57 | IC2.12 80.8,30.96 v81.28,30.96 | v107.31,26.52 IC10.6 IC10.5 109.6,28.17 110.22,28.79 C44.2 | 111.14,22.71 v112.39,22.71 | v116.59,23.72 117.68,23.72 | 30.43,61.44 v29.08,61.44 | 108.83,22.72 110.87,22.72 C33.2 | LED1.C v124.71,31.98 | v124.71,31.98
  Top 1.016: XTAL1.2 117.47,26.21 117.47,23.93 C42.1 117.68,23.72
  Bottom 0.406: v105.98,63.73 105.98,63.28 105.41,62.71 105.41,62.29 106.12,61.58 v106.89,61.58 | C11.1 100.97,59.93 100.97,60.17 | 101.22,63.26 101.22,62.33
  Bottom 1.016: 107.87,53.41 C8.1 | 101.4,48.92 C5.1 | C2.1 96.56,55.73 96.52,55.73
  Bottom 1.27: v111.1,58.61 111.1,58.23 C7.2
  Bottom 1.422: 106.55,90.4 107.7,89.26 | 98.42,90.65 97.54,89.76 | 97.54,89.64 97.03,90.14
  pour Bottom (isolate 0.305, rank 6): 0,100.02 160.02,100.18 160.02,0.48 0,0.48
  pour Top (isolate 0.254, rank 2, no thermals): 91.31,51.16 92.58,49.89 90.81,48.11 89.53,48.11 89.53,50.01 90.81,51.16
  pour Top (isolate 0.305): 87.63,50.65 89.53,48.74 74.93,34.14 72.39,36.68 74.93,39.22 75.56,39.22 87,50.65
GREEN  (2 unrouted)
  Top 0.813: R11.2 R6.2
HS  (2 unrouted)
HS-IN  (1 unrouted)
  Top 0.203: 109.22,70.97 109.22,72.87 104.78,77.32 97.79,77.32 95.25,74.78 74.93,74.78 CON2.27
HS-TTL  (1 unrouted)
INT  (1 unrouted)
  Bottom 0.61: R13.1 TP4.1 130.18,55.73 131.76,54.14 Q1.1
KBCLK  (2 unrouted)
KBCLK-5V  (3 unrouted)
  Top 0.305: U1.4 16.73,41.11 15.24,39.63
KBDAT  (2 unrouted)
KBDAT-5V  (3 unrouted)
  Top 0.305: 11.46,41.73 12.06,41.12 13.77,41.12 U1.3
MSCLK  (2 unrouted)
MSCLK-5V  (3 unrouted)
MSDAT  (2 unrouted)
MSDAT-5V  (3 unrouted)
  Top 0.305: U1.1 13.77,44.93 12.06,44.93 11.46,44.33
N$1  (1 unrouted)
N$2  (1 unrouted)
N$3  (1 unrouted)
N$4
  Bottom 0.61: JP1.7 JP1.5 JP1.3 JP1.1 Q1.3
N$6  (1 unrouted)
  Bottom 0.406: C24.1 C22.1
N$341
  Top 0.203: 120.62,36.06 120.63,36.04 120.65,36.04 | R1.2 120.62,36.06 | 120.62,36.06 120.51,36.17
  Top 0.61: LED1.A R1.2
PA0
  Top 0.203: IC2.1 73.84,43.76 74.74,43.76 86.41,55.43 86.41,56.33 87.49,57.41 88.41,57.41 IC1.142
PA1
  Top 0.203: IC2.2 74.29,42.41 75.19,42.41 88.58,55.81
  Top 0.254: 88.58,55.81 IC1.144
PA2
  Top 0.203: IC2.3 74.29,40.62 75.19,40.62 85.96,51.39 87.72,51.39 IC1.2
PA3
  Top 0.203: IC2.4 74.74,39.27 75.63,39.27 85.96,49.6 87.34,49.6 IC1.4
PA4
  Top 0.203: IC2.5 75.19,37.92 76.08,37.92 86.86,48.7 87.15,48.7 IC1.5
PA5
  Top 0.203: IC2.18 88.66,28.04 89.55,28.04 99.41,37.9 102.83,37.9 104.78,39.85 104.78,40.34 IC1.38
PA6
  Top 0.203: IC2.19 89.11,26.7 90,26.7 99.54,36.23 103.67,36.23 106.26,38.82 106.26,40.27 IC1.40
PA7
  Top 0.203: IC2.20 89.55,25.35 90.45,25.35 99.54,34.44 103.31,34.44 107.51,38.64 107.51,40.43 IC1.42
PA8
  Top 0.203: IC2.21 90,24 90.9,24 99.54,32.64 102.95,32.64 108.77,38.46 108.77,40.59 IC1.44
PA9
  Top 0.203: IC2.22 90.45,22.65 91.35,22.65 99.54,30.85 102.59,30.85 110.03,38.28 110.03,42.16 IC1.48
PA10
  Top 0.203: IC2.23 99.54,31.74 102.77,31.74 109.4,38.37 109.4,40.66 IC1.45
PA11
  Top 0.203: IC2.24 99.54,33.54 103.13,33.54 108.14,38.55 108.14,40.51 IC1.43
PA12
  Top 0.203: 103.49,35.34 106.89,38.73 106.89,40.35 IC1.41 | IC2.25 99.54,35.34
  Top 0.254: 99.54,35.34 103.49,35.34
PA13
  Top 0.203: IC2.26 99.54,37.13 103.85,37.13 105.63,38.91 105.63,40.19 IC1.39
PA14
  Top 0.203: IC2.27 99.19,38.58 101.6,38.58 IC1.37
PA15
  Top 0.203: IC2.42 85.96,52.29 87.91,52.29 IC1.1
PB/!PC!
  Top 0.203: IC2.43 87.31,55.43 87.31,56.33 87.85,56.87 88.25,56.87 IC1.143
PCLK  (via drill 0.3)
  Top 0.254: IC1.20 95.31,46.26 94.61,45.57 94.36,45.31 v92.71,45.31
  Top 0.406: IC10.1 v104.78,25.25
  Bottom 0.406: v92.71,45.31 92.71,37.31 v104.78,25.25
PD0
  Top 0.203: IC2.7 79.23,38.37 79.23,39.27 88.66,48.7 88.66,49.5 IC1.6
PD1
  Top 0.203: IC2.8 80.57,37.92 80.57,38.82 90,48.25 90.94,48.25 IC1.11
PD2
  Top 0.203: IC2.9 81.92,37.47 81.92,38.37 90,46.45 90.56,46.45 IC1.13
PD3
  Top 0.203: IC2.10 83.27,37.02 83.27,37.92 90,44.66 90.18,44.66 IC1.15
PD4
  Top 0.203: IC2.13 85.96,34.33 85.96,35.23 89.37,38.63 89.37,38.9 IC1.22
PD5
  Top 0.203: IC2.14 86.86,33.43 87.76,33.43 93.97,39.64 93.97,39.96 IC1.27
PD6
  Top 0.203: IC1.29 95.76,40.34 95.76,39.64 88.21,32.08 87.31,32.08 IC2.15
PD7
  Top 0.203: IC1.31 97.56,40.72 97.56,39.64 88.66,30.74 87.76,30.74 IC2.16
PD8
  Top 0.203: IC1.30 96.66,40.53 96.66,39.64 IC2.29
PD9
  Top 0.203: IC2.30 94.86,39.64 94.86,40.15 IC1.28
PD10
  Top 0.203: IC2.31 91.16,37.73 91.16,39.28 IC1.24
PD11
  Top 0.203: IC2.32 90.27,38.63 90.27,39.09 IC1.23
PD12
  Top 0.203: 85.03,38.8 IC1.16
  Top 0.254: IC2.35 85.03,38.8
PD13
  Top 0.203: IC2.36 90,45.55 90.37,45.55 IC1.14
PD14
  Top 0.203: IC2.37 90,47.35 90.75,47.35 IC1.12
PD15
  Top 0.203: IC2.38 89.55,48.7 89.55,49.69 IC1.7
PIXCLK  (via drill 0.3)
  Top 0.203: IC1.109 100.33,68.83 v100.33,69.32
  Bottom 0.203: CON3.33 85.34,84.3 v100.33,69.32
PIXCLK-IN  (via drill 0.3)  (1 unrouted)
  Top 0.203: v114.68,66.14 114.68,65.62 IC1.89
  Bottom 0.203: v114.68,66.14 109.86,70.97
R0  (2 unrouted)
R0-IN  (1 unrouted)
  Top 0.203: 108.58,70.33 108.58,72.87 104.78,76.68 97.79,76.68 95.25,74.14 73.03,74.14 CON2.25
R1  (2 unrouted)
R1-IN  (1 unrouted)
  Top 0.203: 107.95,69.7 107.95,72.87 104.78,76.05 97.79,76.05 95.25,73.51 71.12,73.51 CON2.23
RED  (3 unrouted)
SCL
  Top 0.203: 111.12,42.48 IC1.50
  Top 0.254: 111.12,42.48 111.76,41.84 111.76,41.76 111.76,37.31 104.78,30.33 IC10.8 104.78,26.52 102.23,23.98 R16.1
SDA
  Top 0.203: IC1.51 110.01,44.3 110.49,44.3 112.39,42.39
  Top 0.254: R15.1 105.41,24.61 106.05,25.25 IC10.7 106.05,29.69 113.03,36.68 113.03,41.76 112.39,42.39
SKBRX  (1 unrouted)
SKBRX-5V  (2 unrouted)
SKBTX  (1 unrouted)
SKBTX-5V  (2 unrouted)
SMSRX  (1 unrouted)
SMSRX-5V  (2 unrouted)
STATUS
  Top 0.203: IC1.59 118.11,41.85 118.11,39.85 118.75,39.22
  Top 0.254: 118.75,39.22 119.41,38.55 R1.1
TCK  (via drill 0.3)
  Top 0.254: IC1.35 102.69,43.03 v103.25,43.03 | CON1.1 116.84,8.74 127,8.74 128.27,10.01 128.27,14.45 126.36,16.36 v126.36,29.06
  Bottom 0.203: 108.58,37.95 108.33,37.95 v103.25,43.03
  Bottom 0.254: 108.58,37.95 117.47,37.95 v126.36,29.06 | RN1.2 113.27,11.04 114.3,10.01 CON1.1
TDI  (via drill 0.3)
  Top 0.254: CON1.9 127,11.28 127,14.45 125.73,15.72 v125.73,28.42 | IC1.34 101.6,42.64 v101.6,43.66
  Bottom 0.254: v125.73,28.42 117.47,36.68 108.58,36.68 v101.6,43.66 | RN1.1 113.73,11.84 114.3,11.28 124.46,11.28 CON1.9
TDO  (via drill 0.3)
  Top 0.254: IC1.36 101.6,39.98 v101.6,39.85 | v124.46,27.15 124.46,16.99 121.92,14.45 120.65,14.45 119.38,13.18 119.38,11.28 CON1.3
  Bottom 0.254: v101.6,39.85 102.87,39.85 108.58,34.14 117.47,34.14 v124.46,27.15 | RN1.3 112.8,10.24 114.3,8.74 116.84,8.74 CON1.3
TMS  (via drill 0.3)
  Top 0.254: IC1.33 100.97,42.72 v100.97,43.03 | v125.09,27.79 125.09,16.36 121.92,13.18 121.92,11.28 CON1.5
  Bottom 0.254: v100.97,43.03 108.58,35.41 117.47,35.41 v125.09,27.79 | RN1.4 112.33,9.44 114.3,7.47 118.11,7.47 CON1.5
VCC  (via drill 0.3)  (4 unrouted)
  Top 0.254: RN3.8 RN3.7 RN3.6 RN3.5
  Top 0.813: EXP.C3 EXP.B3 EXP.A3
  Top 1.016: EXP.A32 EXP.B32 EXP.C32
  Bottom 0.203: v140.72,78.33 C30.1
  Bottom 0.406: C43.1 141.88,33.88 v140.59,33.88 | C29.1 v143.13,43.03 | C31.1 v143.38,66.4 | C26.1 C25.1
  Bottom 0.61: C27.1 v3.81,78.59
  other vias: 109.86,91.92 111.12,91.92 112.39,91.92 113.67,91.92 114.94,91.92 116.2,91.92 117.47,91.92 118.75,91.92 120.02,91.92 121.28,91.92 109.86,90.65 109.86,89.38 109.86,88.11 111.12,86.84 112.39,85.57 111.12,90.65 111.12,89.38 111.12,88.11 112.39,86.84 113.67,86.84 114.94,86.84 116.2,86.84 117.47,86.84 118.75,86.84 112.39,88.11 112.39,89.38 112.39,90.65 113.67,90.65 113.67,89.38 113.67,88.11 114.94,90.65 114.94,89.38 114.94,88.11 116.2,90.65 116.2,89.38 116.2,88.11 117.47,90.65 117.47,89.38 117.47,88.11 118.75,90.65 118.75,89.38 118.75,88.11 120.02,90.65 120.02,89.38 120.02,88.11 120.02,86.84 113.67,85.57 114.94,85.57 116.2,85.57 117.47,85.57 118.75,85.57 120.02,85.57 121.28,85.57 121.28,90.65 121.28,89.38
  pour Top (isolate 0.305, rank 6): 0,100.18 0,-0.15 160.66,-0.15 160.66,100.18
  pour Bottom (isolate 0.305, rank 2, no thermals): 109.22,91.92 109.22,87.48 113.67,83.03 117.47,83.03 117.47,77.19 123.95,77.19 123.83,79.86 123.83,82.4 122.3,83.92 122.3,92.05 121.67,92.68 109.86,92.56
VCCINT  (via drill 0.3)  (1 unrouted)
  Top 0.203: IC1.90 111.12,62.78 111.12,62.97
  Top 0.254: 108.97,60.55 108.97,60.62 IC1.90 109.98,61.63 | IC1.19 96.08,47.73 96.39,47.73 96.52,47.85 | IC1.56 109.23,48.62 109.22,48.62 | IC1.126 95.95,61.19 96.01,61.19
  Top 0.406: 108.97,60.55 106.43,58.02 106.43,57.54 | 96.52,47.85 98.35,49.68 v98.35,51.25 | 109.22,48.62 107.48,50.35 v105.53,50.35 | 96.01,61.19 98.77,58.43 v99.25,58.43
  Bottom 1.016: v99.25,58.43 100.4,57.28 C11.2 | v98.35,51.25 99.5,52.41 C2.2 | v105.53,50.35 104.38,51.51 C5.2
  other vias: 106.43,57.51
  pour Bottom (isolate 0.406, rank 5, no thermals): 103.4,60.8 98.52,55.92 98.52,55.63 arc90 98.55,55.6 99.95,54.2 98.68,52.93 100.97,50.65 101.22,50.65 103,52.43 104.14,51.28 104.67,51.28 107.47,54.09 108.92,55.54 107.95,56.74 107.95,58.9 106.55,60.05 104.52,60.05 103.64,60.8
  pour Bottom (isolate 0.406, no thermals): 106.68,78.59 122.17,78.59 122.94,79.35 122.94,81.51 123.83,82.4 125.09,82.4 125.09,69.7 115.57,60.17 109.22,60.17 107.31,58.27 106.05,59.54 107.95,61.44 107.95,64.62 102.87,69.7 102.87,74.78
  pour Top (isolate 0.406, no thermals): 109.86,62.08 110.87,61.19 114.68,65 114.68,67.54 109.86,62.71
VS  (2 unrouted)
VS-IN  (1 unrouted)
  Top 0.203: 109.86,71.6 109.86,72.87 104.78,77.95 97.79,77.95 95.25,75.41 76.83,75.41 CON2.29
VS-TTL  (1 unrouted)
WS
  Top 0.203: IC1.87 118.01,67.54 127.64,67.54 TP3.1
  Bottom 0.203: TP3.1 130.98,68.17 R14.1
  Bottom 0.406: Q2.1 130.98,68.43 R14.1

## Text on the board
tNames: Exp out | GND | GND | Video out | Keyboard & Mouse | Expansion in | VGA out | CK | VS | HS | B | G | R | R0 | R1 | G0 | G1 | B0 | B1 | 1.8V CPLD Core | VGA | WS (3.3V) | INT (3.3V) | 640x480 72-75 Hz | IRQ3 | Altera | IRQ4 | 5BM1270ZT144 | IRQ | IRQ2 | CON7 | 1: PS/2 Kbd clock | 2: PS/2 Kbd data | 3: PS/2 Mouse data | 4: PS/2 Mouse clock | 5: Sun Kbd Receive | 6: Do not connect | 7: Sun Kbd Transmit | 8: +5V DC | GND | 3V3 | GND | 9: GND | 10: Sun Mouse Receive | (c) 2012-2016 AlexiosC | JTAG | INT (3.3V) | TCK | TDO | TMS | TDI | 1337 | CFT Minicomputer Video Display Unit rev G
bNames: 1.8V DC | www.bedroomlan.org/cft | (c) 2012-2013 AlexiosC | 1337 | CFT Minicomputer Video Display Unit rev F